# EAGLE board edcmain (EAGLE 9.6.2), part 1 of 2
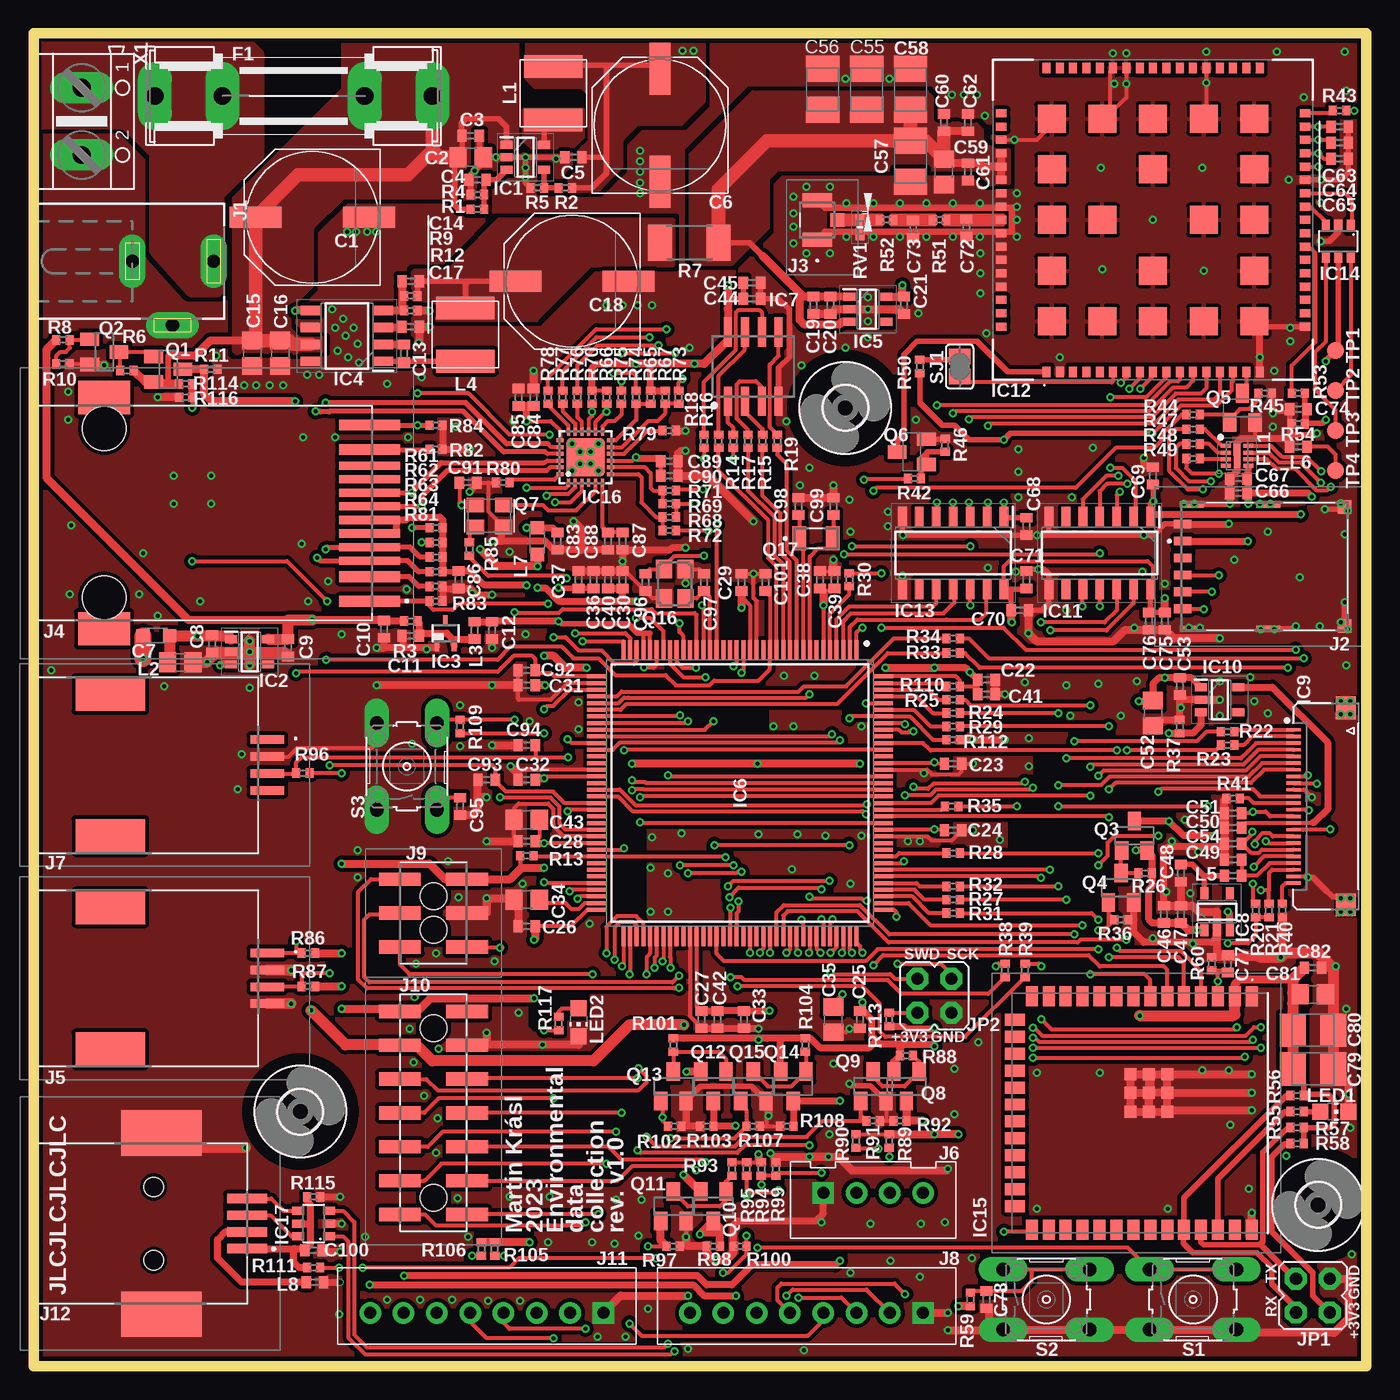
[diagram p7: board, top side]
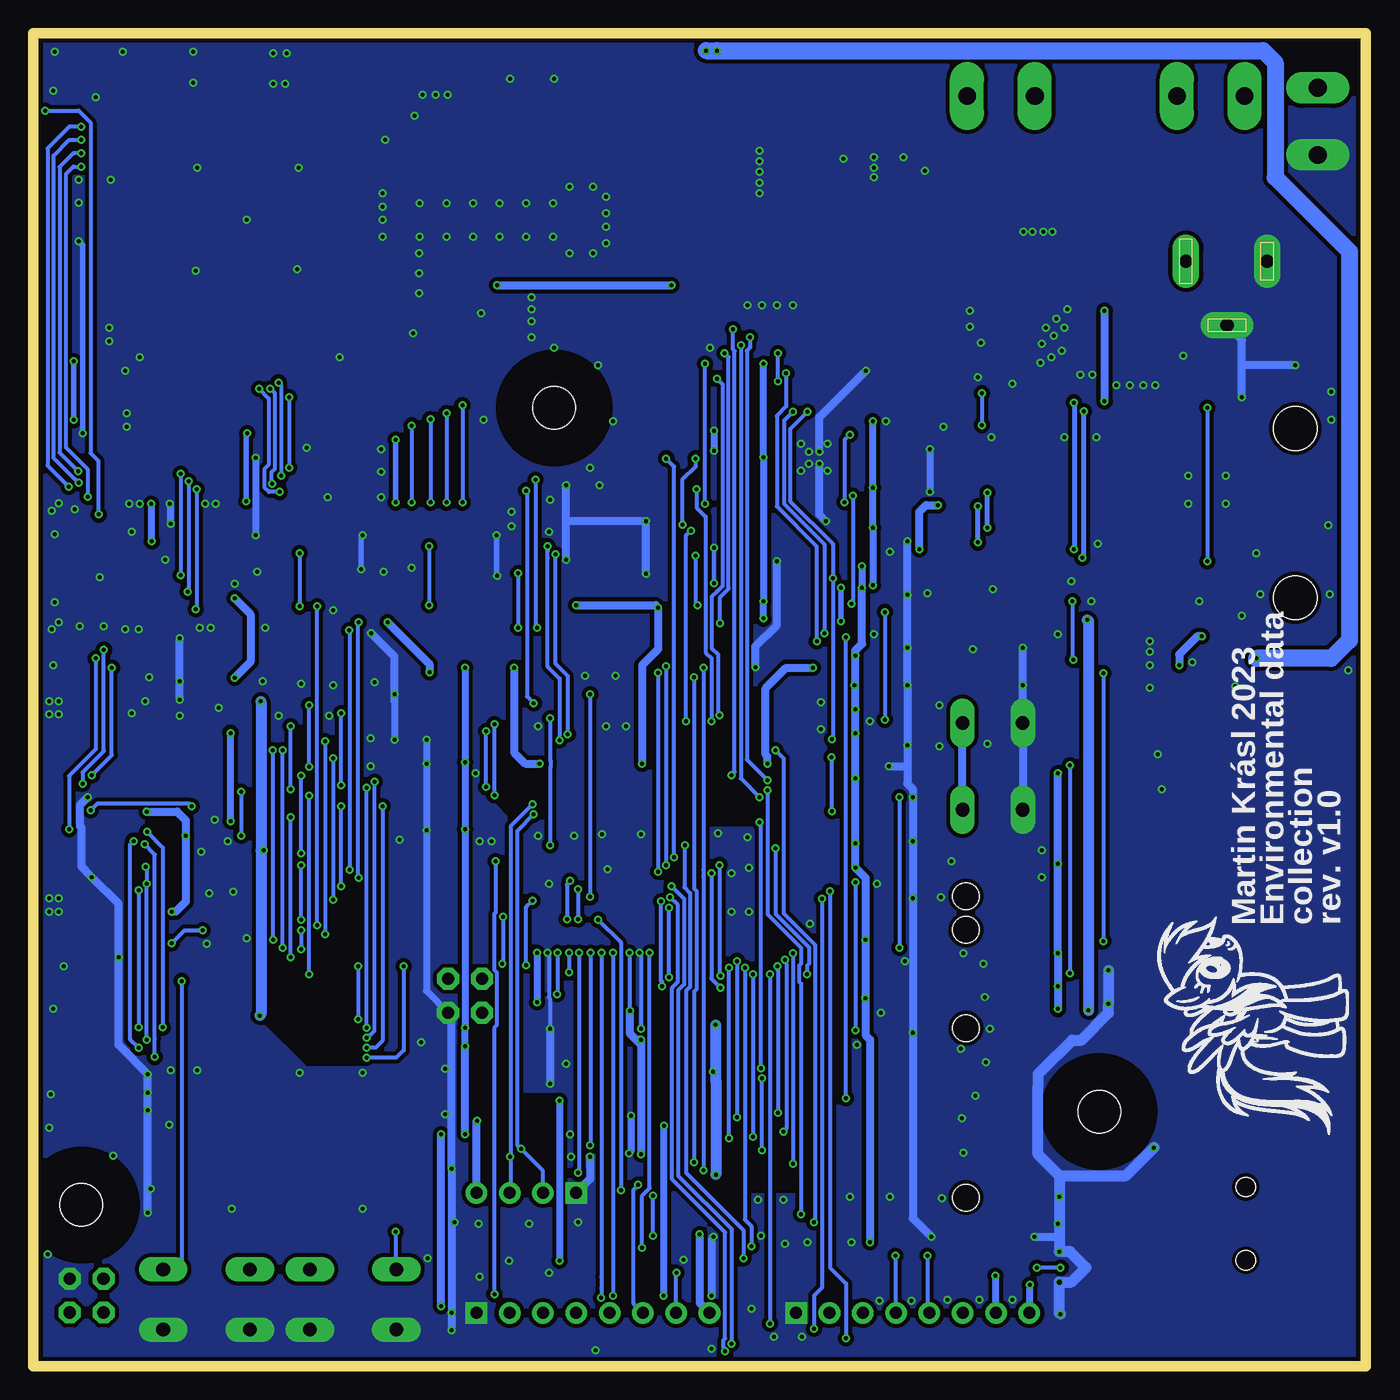
[diagram p8: board, bottom side, seen from below]

Size 100 x 100 mm. Coordinates in mm from the lower left corner, seen from the top.
Outline: 0,0 0,100 100,100 100,0 0,0
Copper layers (1*16): Top 0.035mm / dielectric 1.6mm / Bottom 0.035mm
Design rules "custom-jlcpcb": minimum track width 5mil, minimum drill 0.3mm, track to track 5mil, track to pad 5mil, pad to pad 5mil, via to via 5mil, smd to smd 0mil, copper to edge 0.2mm, drill to drill 6mil, minimum pad ring 10mil, minimum via ring 3mil, stop-mask expansion 4mil, vias tented up to drill 0.4mm, thermal gap 10mil
Net classes: 0 default: width 0.152 mm, clearance 0.152 mm; 1 usb: width 0.305 mm, clearance 0.203 mm; 2 ETH: width 0.305 mm, clearance 0.203 mm

## Footprints (pad centres in the part's own frame; a part is rotated, then mirrored left to right if it is on the bottom)
PANASONIC_G = smd 3.9 x 1.6: + 4.25,0; - -4.25,0
C0805 = smd 1.3 x 1.5: 1 -0.95,0; 2 0.95,0
C0402 = smd 0.7 x 0.9: 1 -0.65,0; 2 0.65,0
B/3528-21R = smd 1.95 x 2.5: + 1.525,0; - -1.525,0
SHK20L = drill 1.321 pad 2.54 long: 1A -10.414,0; 1B -5.334,0; 2A 10.414,0; 2B 5.334,0
SON50P160X210X65-9N = smd 0.75 x 0.3: 1 -0.85,0.75; 2 -0.85,0.25; 3 -0.85,-0.25; 4 -0.85,-0.75; 5 0.85,-0.75; 6 0.85,-0.25; 7 0.85,0.25; 8 0.85,0.75 | smd 0.5 x 1.8: 9 0,0
3,2 = hole 3.2: 0,0
SOT95P280X130-5N = smd 0.9 x 0.6: 1 -1.4,0.95; 2 -1.4,0; 3 -1.4,-0.95; 4 1.4,-0.95; 5 1.4,0.95
SC70-3 = smd 0.35 x 0.8: 1 -0.65,-0.95; 2 0.65,-0.95; 3 0,0.95
SOIC127P600X175-8N = smd 1.525 x 0.7: 1 -2.712,1.905; 2 -2.712,0.635; 3 -2.712,-0.635; 4 -2.712,-1.905; 5 2.712,-1.905; 6 2.712,-0.635; 7 2.712,0.635; 8 2.712,1.905
QFP50P2200X2200X160-144N = smd 1.475 x 0.3: 1 -10.738,8.75; 2 -10.738,8.25; 3 -10.738,7.75; 4 -10.738,7.25; 5 -10.738,6.75; 6 -10.738,6.25; 7 -10.738,5.75; 8 -10.738,5.25; 9 -10.738,4.75; 10 -10.738,4.25; 11 -10.738,3.75; 12 -10.738,3.25; 13 -10.738,2.75; 14 -10.738,2.25; 15 -10.738,1.75; 16 -10.738,1.25; 17 -10.738,0.75; 18 -10.738,0.25; 19 -10.738,-0.25; 20 -10.738,-0.75; 21 -10.738,-1.25; 22 -10.738,-1.75; 23 -10.738,-2.25; 24 -10.738,-2.75; 25 -10.738,-3.25; 26 -10.738,-3.75; 27 -10.738,-4.25; 28 -10.738,-4.75; 29 -10.738,-5.25; 30 -10.738,-5.75; 31 -10.738,-6.25; 32 -10.738,-6.75; 33 -10.738,-7.25; 34 -10.738,-7.75; 35 -10.738,-8.25; 36 -10.738,-8.75; 73 10.738,-8.75; 74 10.738,-8.25; 75 10.738,-7.75; 76 10.738,-7.25; 77 10.738,-6.75; 78 10.738,-6.25; 79 10.738,-5.75; 80 10.738,-5.25; 81 10.738,-4.75; 82 10.738,-4.25; 83 10.738,-3.75; 84 10.738,-3.25; 85 10.738,-2.75; 86 10.738,-2.25; 87 10.738,-1.75; 88 10.738,-1.25; 89 10.738,-0.75; 90 10.738,-0.25; 91 10.738,0.25; 92 10.738,0.75; 93 10.738,1.25; 94 10.738,1.75; 95 10.738,2.25; 96 10.738,2.75; 97 10.738,3.25; 98 10.738,3.75; 99 10.738,4.25; 100 10.738,4.75; 101 10.738,5.25; 102 10.738,5.75; 103 10.738,6.25; 104 10.738,6.75; 105 10.738,7.25; 106 10.738,7.75; 107 10.738,8.25; 108 10.738,8.75 | smd 0.3 x 1.475: 37 -8.75,-10.738; 38 -8.25,-10.738; 39 -7.75,-10.738; 40 -7.25,-10.738; 41 -6.75,-10.738; 42 -6.25,-10.738; 43 -5.75,-10.738; 44 -5.25,-10.738; 45 -4.75,-10.738; 46 -4.25,-10.738; 47 -3.75,-10.738; 48 -3.25,-10.738; 49 -2.75,-10.738; 50 -2.25,-10.738; 51 -1.75,-10.738; 52 -1.25,-10.738; 53 -0.75,-10.738; 54 -0.25,-10.738; 55 0.25,-10.738; 56 0.75,-10.738; 57 1.25,-10.738; 58 1.75,-10.738; 59 2.25,-10.738; 60 2.75,-10.738; 61 3.25,-10.738; 62 3.75,-10.738; 63 4.25,-10.738; 64 4.75,-10.738; 65 5.25,-10.738; 66 5.75,-10.738; 67 6.25,-10.738; 68 6.75,-10.738; 69 7.25,-10.738; 70 7.75,-10.738; 71 8.25,-10.738; 72 8.75,-10.738; 109 8.75,10.738; 110 8.25,10.738; 111 7.75,10.738; 112 7.25,10.738; 113 6.75,10.738; 114 6.25,10.738; 115 5.75,10.738; 116 5.25,10.738; 117 4.75,10.738; 118 4.25,10.738; 119 3.75,10.738; 120 3.25,10.738; 121 2.75,10.738; 122 2.25,10.738; 123 1.75,10.738; 124 1.25,10.738; 125 0.75,10.738; 126 0.25,10.738; 127 -0.25,10.738; 128 -0.75,10.738; 129 -1.25,10.738; 130 -1.75,10.738; 131 -2.25,10.738; 132 -2.75,10.738; 133 -3.25,10.738; 134 -3.75,10.738; 135 -4.25,10.738; 136 -4.75,10.738; 137 -5.25,10.738; 138 -5.75,10.738; 139 -6.25,10.738; 140 -6.75,10.738; 141 -7.25,10.738; 142 -7.75,10.738; 143 -8.25,10.738; 144 -8.75,10.738
SOP08 = smd 0.6 x 2.2: 1 -1.905,-2.6; 2 -0.635,-2.6; 3 0.635,-2.6; 4 1.905,-2.6; 5 1.905,2.6; 6 0.635,2.6; 7 -0.635,2.6; 8 -1.905,2.6
XF2M-2415-1A-SWAP = smd 0.25 x 1.1: 1 5.75,2.54; 2 5.25,2.54; 3 4.75,2.54; 4 4.25,2.54; 5 3.75,2.54; 6 3.25,2.54; 7 2.75,2.54; 8 2.25,2.54; 9 1.75,2.54; 10 1.25,2.54; 11 0.75,2.54; 12 0.25,2.54; 13 -0.25,2.54; 14 -0.75,2.54; 15 -1.25,2.54; 16 -1.75,2.54; 17 -2.25,2.54; 18 -2.75,2.54; 19 -3.25,2.54; 20 -3.75,2.54; 21 -4.25,2.54; 22 -4.75,2.54; 23 -5.25,2.54; 24 -5.75,2.54 | smd 1.7 x 1.5: 25 -7.4,-1.36; 26 7.4,-1.36
SOIC127P600X175-14N = smd 1.525 x 0.65: 1 -2.712,3.81; 2 -2.712,2.54; 3 -2.712,1.27; 4 -2.712,0; 5 -2.712,-1.27; 6 -2.712,-2.54; 7 -2.712,-3.81; 8 2.712,-3.81; 9 2.712,-2.54; 10 2.712,-1.27; 11 2.712,0; 12 2.712,1.27; 13 2.712,2.54; 14 2.712,3.81
A7670CLNSC = smd 0.8 x 0.6: 1 -11.4,8; 2 -11.4,7; 3 -11.4,6; 4 -11.4,5; 5 -11.4,4; 6 -11.4,3; 7 -11.4,2; 8 -11.4,1; 9 -11.4,0; 10 -11.4,-1; 11 -11.4,-2; 12 -11.4,-3; 13 -11.4,-4; 14 -11.4,-5; 15 -11.4,-6; 16 -11.4,-7; 17 -11.4,-8; 35 11.4,-8; 36 11.4,-7; 37 11.4,-6; 38 11.4,-5; 39 11.4,-4; 40 11.4,-3; 41 11.4,-2; 42 11.4,-1; 43 11.4,0; 44 11.4,1; 45 11.4,2; 46 11.4,3; 47 11.4,4; 48 11.4,5; 49 11.4,6; 50 11.4,7; 51 11.4,8 | smd 0.6 x 0.8: 18 -8,-11.4; 19 -7,-11.4; 20 -6,-11.4; 21 -5,-11.4; 22 -4,-11.4; 23 -3,-11.4; 24 -2,-11.4; 25 -1,-11.4; 26 0,-11.4; 27 1,-11.4; 28 2,-11.4; 29 3,-11.4; 30 4,-11.4; 31 5,-11.4; 32 6,-11.4; 33 7,-11.4; 34 8,-11.4; 52 8,11.4; 53 7,11.4; 54 6,11.4; 55 5,11.4; 56 4,11.4; 57 3,11.4; 58 2,11.4; 59 1,11.4; 60 0,11.4; 61 -1,11.4; 62 -2,11.4; 63 -3,11.4; 64 -4,11.4; 65 -5,11.4; 66 -6,11.4; 67 -7,11.4; 68 -8,11.4 | smd 2.1 x 2.1: 69 -7.6,7.6; 70 -7.6,3.8; 71 -7.6,0; 72 -7.6,-3.8; 73 -7.6,-7.6; 74 -3.8,-7.6; 75 0,-7.6; 76 3.8,-7.6; 77 7.6,-7.6; 78 7.6,-3.8; 79 7.6,0; 80 7.6,3.8; 81 7.6,7.6; 82 3.8,7.6; 83 0,7.6; 84 -3.8,7.6; 85 -3.8,0; 86 0,-3.8; 87 3.8,0; 88 0,3.8
SOT23-6 = smd 0.6 x 0.9: 1 -0.95,-1.15; 2 0,-1.15; 3 0.95,-1.15; 4 0.95,1.15; 5 0,1.15; 6 -0.95,1.15
ESP32S3WROOM1UN16R2 = smd 1.5 x 0.9: 1 -8.75,8.41; 2 -8.75,7.14; 3 -8.75,5.87; 4 -8.75,4.6; 5 -8.75,3.33; 6 -8.75,2.06; 7 -8.75,0.79; 8 -8.75,-0.48; 9 -8.75,-1.75; 10 -8.75,-3.02; 11 -8.75,-4.29; 12 -8.75,-5.56; 13 -8.75,-6.83; 14 -8.75,-8.1; 27 8.75,-8.1; 28 8.75,-6.83; 29 8.75,-5.56; 30 8.75,-4.29; 31 8.75,-3.02; 32 8.75,-1.75; 33 8.75,-0.48; 34 8.75,0.79; 35 8.75,2.06; 36 8.75,3.33; 37 8.75,4.6; 38 8.75,5.87; 39 8.75,7.14; 40 8.75,8.41 | smd 0.9 x 1.5: 15 -6.985,-9.35; 16 -5.715,-9.35; 17 -4.445,-9.35; 18 -3.175,-9.35; 19 -1.905,-9.35; 20 -0.635,-9.35; 21 0.635,-9.35; 22 1.905,-9.35; 23 3.175,-9.35; 24 4.445,-9.35; 25 5.715,-9.35; 26 6.985,-9.35 | smd 0.9 x 0.9: 41 -1.5,0.69; 42 -1.5,2.09; 43 -2.9,2.09; 44 -2.9,0.69; 45 -2.9,-0.71; 46 -1.5,-0.71; 47 -0.1,-0.71; 48 -0.1,0.69; 49 -0.1,2.09
QFN24 = smd 0.6 x 0.3: 1 -1.905,1.27; 2 -1.905,0.762; 3 -1.905,0.254; 4 -1.905,-0.254; 5 -1.905,-0.762; 6 -1.905,-1.27; 13 1.905,-1.27; 14 1.905,-0.762; 15 1.905,-0.254; 16 1.905,0.254; 17 1.905,0.762; 18 1.905,1.27 | smd 0.3 x 0.6: 7 -1.27,-1.905; 8 -0.762,-1.905; 9 -0.254,-1.905; 10 0.254,-1.905; 11 0.762,-1.905; 12 1.27,-1.905; 19 1.27,1.905; 20 0.762,1.905; 21 0.254,1.905; 22 -0.254,1.905; 23 -0.762,1.905; 24 -1.27,1.905 | smd 2.9 x 2.9: EXP 0,0
DCJ0202 = drill 1 pad 2 long: 1 0,3.1; 2 4.8,0; 3 0,-3
693043020611 = smd 0.65 x 1.3: C1 1.91,5.77; C2 -0.63,5.77; C3 -1.9,5.77; C5 3.18,5.77; C6 0.64,5.77; C7 -3.17,5.77 | smd 0.48 x 1.8: P1 -4.67,5.1; P2 -4.67,-0.65; P5 4.66,-0.65; P6 4.66,5.1 | smd 1.03 x 1: P3 -4.465,-6.37; P4 4.465,-6.37
UFLRSMT01 = smd 1.05 x 2.2: 1 -1.475,0; 2 1.475,0 | smd 1 x 1.05: 3 0,-1.525
J3011G21DNL = smd 0.81 x 4.6: 1 6.61,25.2; 2 4.77,25.2; 11 -4.77,25.2; 12 -6.61,25.2 | smd 0.61 x 4.6: 3 3.57,25.2; 4 2.55,25.2; 5 1.53,25.2; 6 0.51,25.2; 7 -0.51,25.2; 8 -1.53,25.2; 9 -2.55,25.2; 10 -3.57,25.2 | smd 2.5 x 3.9: MP1 8.67,5.28; MP2 -8.67,5.28 | hole 3.3: 6.35,5.28; -6.35,5.28
441440004 = smd 0.64 x 2.54: 1 -1.905,9.135; 2 -0.635,9.135; 3 0.635,9.135; 4 1.905,9.135 | smd 2.54 x 5.21: MP1 -5.33,-2.66; MP2 5.33,-2.66
B4B-XH-A = drill 0.9 square: 1 3.75,0 | drill 0.9: 2 1.25,0; 3 -1.25,0; 4 -3.75,0
B8B-XH-A = drill 0.9 square: 1 8.75,0 | drill 0.9: 2 6.25,0; 3 3.75,0; 4 1.25,0; 5 -1.25,0; 6 -3.75,0; 7 -6.25,0; 8 -8.75,0
M208750342 = smd 1 x 3.15: 1 -2.54,-2.525; 2 -2.54,2.525; 3 0,-2.525; 4 0,2.525; 5 2.54,-2.525; 6 2.54,2.525 | hole 2: -1.27,0; 1.27,0
M208750742 = smd 1 x 3.15: 1 -7.62,-2.525; 2 -7.62,2.525; 3 -5.08,-2.525; 4 -5.08,2.525; 5 -2.54,-2.525; 6 -2.54,2.525; 7 0,-2.525; 8 0,2.525; 9 2.54,-2.525; 10 2.54,2.525; 11 5.08,-2.525; 12 5.08,2.525; 13 7.62,-2.525; 14 7.62,2.525 | hole 2: -6.35,0; 6.35,0
62910416121 = smd 0.7 x 3: 1 1.875,16; 2 -0.625,16; 3 -1.875,16; 4 0.625,16 | smd 3.4 x 6.04: MP1 6.8,9.6; MP2 -6.8,9.6 | hole 1.45: 2.75,9; -2.75,9
JP2Q = drill 0.914 octagon: 1 -1.27,-1.27; 2 -1.27,1.27; 3 1.27,-1.27; 4 1.27,1.27
L6 = smd 1.7 x 4.4: P$1 -2,0; P$2 2,0
L2012C = smd 1 x 1: 1 -1,0; 2 1,0
0402 = smd 0.7 x 0.9: 1 -0.65,0; 2 0.65,0
CHIP-LED0805 = smd 1.2 x 1.2: A 0,-1.05; C 0,1.05
SOT23 = smd 1 x 1.4: 1 -0.95,-1.1; 2 0.95,-1.1; 3 0,1.1
SOT23-BEC = smd 1 x 1.4: B -0.95,-1.1; C 0,1.1; E 0.95,-1.1
CRYSTAL3.2X2.5 = smd 1.295 x 1.092: 1 -1.054,-0.826; 2 1.054,-0.826; 3 1.054,0.826; 4 -1.054,0.826
CRYSTAL3.2X2.5' = smd 1.4 x 1.2: 1 -1.1,-0.8; 2 1.1,-0.8; 3 1.1,0.8; 4 -1.1,0.8
NX3215SA32768KEXS00AMU00003 = smd 1 x 1.8: 1 -1.25,0; 2 1.25,0
R0402 = smd 0.6 x 0.7: 1 -0.5,0; 2 0.5,0
R2010 = smd 1.8 x 2.7: 1 -2.2,0; 2 2.2,0
VARC1005X41N = smd 0.85 x 0.65: 1 -0.55,0; 2 0.55,0
B3F-10XX = drill 1.016 long: 1 -3.251,2.261; 2 3.251,2.261; 3 -3.251,-2.261; 4 3.251,-2.261
SJ = smd 1.168 x 1.6: 1 -0.762,0; 2 0.762,0
B1,27 = smd 1.27 x 1.27: TP 0,0
AK500/2 = drill 1.321 long: 1 -2.515,0; 2 2.515,0

## Placement (x,y rotation side)
C1  330uF  [PANASONIC_G]  20.9,86.2 180 top
C2  1uF  [C0805]  32.8,90.7 0 top
C3  100nF  [C0402]  32.8,92.3 0 top
C4  100nF  [C0402]  33.3,89 180 top
C5  100nF  [C0402]  40.5,90.7 180 top
C6  330uF  [PANASONIC_G]  47,93.1 90 top
C7  2.2uF  [C0805]  11,52.8 0 top
C8  100nF  [C0402]  13.4,54.2 270 top
C9  100nF  [C0402]  19.1,53.9 270 top
C10  100nF  [C0402]  26.3,55.3 270 top
C11  100nF  [C0402]  28.3,54.8 180 top
C12  100nF  [C0402]  34.4,55.2 270 top
C13  100nF  [C0402]  27.8,76 270 top
C14  15pF  [C0402]  28.3,81.4 180 top
C15  1uF  [C0805]  16.4,76 270 top
C16  1uF  [C0805]  18.5,76 270 top
C17  1uF  [C0402]  28.3,78 0 top
C18  33uF  [PANASONIC_G]  40.4,81.4 180 top
C19  2.2uF  [C0402]  58.5,79.6 270 top
C20  100nF  [C0402]  59.8,79.6 270 top
C21  100nF  [C0402]  65.3,79.6 270 top
C22  100nF  [C0402]  71.5,51.5 0 top
C23  100nF  [C0402]  69,45.2 0 top
C24  100nF  [C0402]  69,40.2 0 top
C25  100nF  [C0402]  62,26 270 top
C26  100nF  [C0402]  37,33 180 top
C27  100nF  [C0402]  50.1,26 270 top
C28  100nF  [C0402]  37,39.4 180 top
C29  100nF  [C0402]  53.1,58.8 90 top
C30  100nF  [C0402]  44.2,59 90 top
C31  100nF  [C0402]  37,51.1 180 top
C32  100nF  [C0402]  37,44 180 top
C33  4.7uF  [C0402]  53.3,26 270 top
C34  2.2uF  [C0805]  37,35 180 top
C35  2.2uF  [C0805]  60,26 270 top
C36  100nF  [C0402]  42,59 90 top
C37  1.0uF  [C0402]  40.9,59 90 top
C38  100nF  [C0402]  59,59 90 top
C39  1uF  [C0402]  60.1,59 90 top
C40  2.2uF  [C0402]  43.1,59 90 top
C41  2.2uF  [C0402]  71.5,50.4 0 top
C42  2.2uF  [C0402]  51.3,26 270 top
C43  2.2uF  [C0805]  37,41 180 top
C44  100nF  [C0402]  53.9,80.1 0 top
C45  2.2uF  [C0402]  53.9,81.3 0 top
C46  2.2uF  [C0402]  84.8,33.9 90 top
C47  100nF  [C0402]  86.1,33.9 90 top
C48  100nF  [C0402]  86.1,37 270 top
C49  100nF  [C0402]  90,38 180 top
C50  100nF  [C0402]  90,40.4 180 top
C51  100nF  [C0402]  90,41.5 180 top
C52  2.2uF  [C0805]  84,49 270 top
C53  100nF  [C0402]  86,51 270 top
C54  100nF  [C0402]  90,39.2 180 top
C55  100uF  [B/3528-21R]  62.5,95.8 270 top
C56  100uF  [B/3528-21R]  59.2,95.8 270 top
C57  100uF  [B/3528-21R]  65.8,90.4 90 top
C58  100uF  [B/3528-21R]  65.8,95.8 270 top
C59  1uF  [C0805]  68.3,89.6 270 top
C60  100nF  [C0402]  68.3,93.3 90 top
C61  33pF  [C0402]  70.1,89.6 270 top
C62  10pF  [C0402]  70.1,93.3 90 top
C63  22pF  [C0402]  98,93 0 top
C64  22pF  [C0402]  98,91.8 0 top
C65  22pF  [C0402]  98,90.6 0 top
C66  33pF  [C0402]  90.4,65.5 180 top
C67  100nF  [C0402]  90.4,66.6 180 top
C68  100nF  [C0402]  74.5,63 270 top
C69  100nF  [C0402]  84,66.8 90 top
C70  2.2uF  [C0402]  74,56.7 0 top
C71  100nF  [C0402]  74.5,59 90 top
C72  DNF  [C0402]  70,85.4 270 top
C73  DNF  [C0402]  66,85.3 270 top
C74  4.7uF  [C0402]  94.9,71.8 180 top
C75  2.2uF  [C0402]  84.9,55.9 270 top
C76  100nF  [C0402]  83.7,55.9 270 top
C77  100nF  [C0402]  89.6,30.2 90 top
C78  100nF  [C0402]  71.5,5 270 top
C79  100uF  [B/3528-21R]  96,22.3 180 top
C80  100uF  [B/3528-21R]  96,25.2 180 top
C81  1uF  [C0805]  96,27.9 0 top
C82  100nF  [C0402]  96,29.9 0 top
C83  1uF  [C0402]  39.3,61.9 270 top
C84  100nF  [C0402]  37.5,72.7 90 top
C85  100nF  [C0402]  36.4,72.7 90 top
C86  22nF  [C0402]  31.9,59 270 top
C87  470pF  [C0402]  44.2,61.9 270 top
C88  1uF  [C0402]  43.1,61.9 90 top
C89  1uF  [C0402]  47.7,67.9 0 top
C90  100nF  [C0402]  47.7,66.8 0 top
C91  100nF  [C0402]  32.6,66.3 0 top
C92  100pF  [C0402]  37,52.2 180 top
C93  100pF  [C0402]  34,44 180 top
C94  100pF  [C0402]  37,46.6 180 top
C95  100nF  [C0402]  32,42 270 top
C96  20pF  [C0402]  45.9,58.8 270 top
C97  20pF  [C0402]  50.3,58.8 90 top
C98  4p7  [C0402]  57.4,64.5 90 top
C99  4p7  [C0402]  60,64.5 90 top
C100  4.7uF  [C0402]  21,8.7 0 top
C101  10nF  [C0402]  54.9,58.8 90 top
F1  [SHK20L]  19.5,95.3 0 top
FL1  TPD3F303DPVR  [SON50P160X210X65-9N]  90.3,68.3 0 top
H1  MOUNT-HOLE3.2  [3,2]  20,19.1 0 top
H2  MOUNT-HOLE3.2  [3,2]  96.4,12.1 0 top
H3  MOUNT-HOLE3.2  [3,2]  60.9,71.9 0 top
IC1  XC9263B75CMR-G  [SOT95P280X130-5N]  36.9,90.7 0 top
IC2  XC6227C501MR-G  [SOT95P280X130-5N]  16.2,53.6 0 top
IC3  LM4050CEX3-3  [SC70-3]  30.9,55 0 top
IC4  L6981NDR  [SOIC127P600X175-8N]  23.5,77.3 180 top
IC5  XC6210B332MR-G  [SOT95P280X130-5N]  62.6,79.3 0 top
IC6  STM32H723ZGT6  [QFP50P2200X2200X160-144N]  53,43 270 top
IC7  APS6404L-3SQR-SN  [SOP08]  54,75 0 top
IC8  XC6504A281MR-G  [SOT95P280X130-5N]  88.8,34.1 90 top
IC9  OV2640  [XF2M-2415-1A-SWAP]  97.1,42 90 top
IC10  XC6224A121MR-G  [SOT95P280X130-5N]  89,50 0 top
IC11  TXB0104DR  [SOIC127P600X175-14N]  80,61 270 top
IC12  A7670E  [A7670CLNSC]  84,86 90 top
IC13  TXB0104DR  [SOIC127P600X175-14N]  69,61 270 top
IC14  USBLC6-2  [SOT23-6]  97.9,84.4 180 top
IC15  ESP32-S3-WROOM-1U-N16R2  [ESP32S3WROOM1UN16R2]  83,19 270 top
IC16  LAN8720  [QFN24]  41.4,68.2 90 top
IC17  USBLC6-2  [SOT23-6]  21,10.7 90 top
IMG1  IMAGEPRINT  [RD_14_24_PRINT]  8.2,26.6 90 bottom
J1  DCJ0202  [DCJ0202]  10.4,82.9 270 top
J2  693043020611  [693043020611]  92,60 90 top
J3  U.FL-R-SMT_01_  [UFLRSMT01]  58.8,86 90 top
J4  J3011G21DNL  [J3011G21DNL]  0,64 270 top
J5  44144-0004  [441440004]  8.4,29.1 270 top
J6  JST-XH-4  [B4B-XH-A]  63,13 180 top
J7  44144-0004  [441440004]  8.4,45.1 270 top
J8  JST-XH-8  [B8B-XH-A]  58,4 0 top
J9  M20-8750342  [M208750342]  30,34 90 top
J10  M20-8750742  [M208750742]  30,19 90 top
J11  JST-XH-8  [B8B-XH-A]  34,4 0 top
J12  62910416121  [62910416121]  0,10.7 270 top
JP1  [JP2Q]  96,5.3 90 top
JP2  [JP2Q]  67.6,27.8 0 top
L1  10uH  [L6]  39,95.5 90 top
L2  LCBB-601  [L2012C]  9.2,54.8 180 top
L3  ferit  [0402]  33.1,55.2 90 top
L4  27uH  [L6]  32.4,77.4 90 top
L5  ferit  [0402]  90,36.8 0 top
L6  ferit  [0402]  94.9,69 0 top
L7  fcm1608-0603  [L2012C]  37.8,61.9 90 top
L8  ferit  [0402]  21.1,6.3 180 top
LED1  [CHIP-LED0805]  97.6,19.1 270 top
LED2  [CHIP-LED0805]  40.9,25.8 180 top
Q1  BSS84  [SOT23]  10.1,74.8 270 top
Q2  BSS123  [SOT23]  5.3,76.1 270 top
Q3  NTR0202PLT1G  [SOT23]  82.6,39.8 0 top
Q4  BSS123  [SOT23]  81.6,35.9 0 top
Q5  BC817-40  [SOT23-BEC]  90.7,71.9 0 top
Q6  BC817-40  [SOT23-BEC]  65.9,68.6 90 top
Q7  ASE-25.000MHZ-LR-T  [CRYSTAL3.2X2.5]  34.2,63.8 0 top
Q8  NTR0202PLT1G  [SOT23]  65.5,21 180 top
Q9  BSS123  [SOT23]  63,21 0 top
Q10  NTR0202PLT1G  [SOT23]  51,12 180 top
Q11  BSS123  [SOT23]  48,12 0 top
Q12  NTR0202PLT1G  [SOT23]  51,21 180 top
Q13  BSS123  [SOT23]  48,21 0 top
Q14  NTR0202PLT1G  [SOT23]  57,21 180 top
Q15  BSS123  [SOT23]  54,21 0 top
Q16  8MHz  [CRYSTAL3.2X2.5']  48.1,58.7 90 top
Q17  32.768kHz  [NX3215SA32768KEXS00AMU00003]  58.7,62.1 0 top
R1  22k  [R0402]  33.3,86.8 0 top
R2  680k  [R0402]  39.9,88.4 0 top
R3  200R  [R0402]  28.3,55.9 180 top
R4  16k  [R0402]  33.3,87.9 0 top
R5  110k  [R0402]  37.8,88.4 0 top
R6  100k  [R0402]  7,74.7 180 top
R7  FERIT?  [R2010]  49.2,84.3 0 top
R8  1k  [R0402]  2.2,77 180 top
R9  300k  [R0402]  28.3,80.3 0 top
R10  100k  [R0402]  2.2,75.2 180 top
R11  1k  [R0402]  13.3,74.8 180 top
R12  80k6  [R0402]  28.3,79.2 180 top
R13  10k  [R0402]  37,38.3 180 top
R14  33R  [R0402]  52.5,69.4 90 top
R15  33R  [R0402]  54.7,69.4 90 top
R16  33R  [R0402]  51.4,69.4 270 top
R17  33R  [R0402]  53.6,69.4 90 top
R18  33R  [R0402]  50.3,69.4 270 top
R19  33R  [R0402]  55.8,69.4 270 top
R20  4k7  [R0402]  91.7,34.2 270 top
R21  4k7  [R0402]  92.7,34.2 270 top
R22  33R  [R0402]  89.6,47.6 180 top
R23  33R  [R0402]  89.6,46.6 180 top
R24  33R  [R0402]  69,49 180 top
R25  33R  [R0402]  69,50 180 top
R26  100k  [R0402]  83.4,37 0 top
R27  33R  [R0402]  69,35 180 top
R28  33R  [R0402]  69,38.5 180 top
R29  33R  [R0402]  69,48 180 top
R30  33R  [R0402]  61.2,59 270 top
R31  33R  [R0402]  69,34 180 top
R32  33R  [R0402]  69,36 180 top
R33  33R  [R0402]  69,53.5 180 top
R34  33R  [R0402]  69,54.6 180 top
R35  33R  [R0402]  68.9,42 180 top
R36  100k  [R0402]  81.6,33.5 180 top
R37  1k  [R0402]  86,48 270 top
R38  33R  [R0402]  72.9,29.7 270 top
R39  33R  [R0402]  74.4,29.7 270 top
R40  10k  [R0402]  93.7,34.2 90 top
R41  10k  [R0402]  90,42.6 0 top
R42  4k7  [R0402]  66.1,66.6 0 top
R43  10k  [R0402]  98,94.2 0 top
R44  4k7  [R0402]  87,71.4 0 top
R45  47k  [R0402]  92.4,73 180 top
R46  47k  [R0402]  68.4,69.1 270 top
R47  22R  [R0402]  87,70.3 180 top
R48  22R  [R0402]  87,69.2 180 top
R49  22R  [R0402]  87,68.1 180 top
R50  10k  [R0402]  66.5,75 270 top
R51  0R  [R0402]  68,86 180 top
R52  0R  [R0402]  64,86 180 top
R53  4k7  [R0402]  94.9,73 180 top
R54  10k  [R0402]  94.9,70.7 0 top
R55  1k  [R0402]  94.8,19.1 0 top
R56  100k  [R0402]  94.8,20.3 0 top
R57  100k  [R0402]  94.8,17.9 0 top
R58  0R  [R0402]  94.8,16.7 0 top
R59  100k  [R0402]  70.3,5 270 top
R60  100k  [R0402]  88.4,30.2 270 top
R61  49R9  [R0402]  30.2,62.9 0 top
R62  49R9  [R0402]  30.2,61.8 0 top
R63  49R9  [R0402]  30.2,60.7 0 top
R64  49R9  [R0402]  30.2,59.6 0 top
R65  1k5  [R0402]  46.3,72.7 90 top
R66  4k7  [R0402]  43,72.7 90 top
R67  4k7  [R0402]  47.4,72.7 90 top
R68  4k7  [R0402]  47.7,63.7 0 top
R69  4k7  [R0402]  47.7,64.7 0 top
R70  4k7  [R0402]  41.9,72.7 90 top
R71  22R  [R0402]  47.7,65.7 180 top
R72  22R  [R0402]  47.7,62.7 180 top
R73  22R  [R0402]  48.4,72.7 270 top
R74  22R  [R0402]  45.2,72.7 270 top
R75  22R  [R0402]  44.1,72.7 270 top
R76  22R  [R0402]  40.8,72.7 270 top
R77  22R  [R0402]  39.7,72.7 270 top
R78  22R  [R0402]  38.6,72.7 270 top
R79  4k7  [R0402]  47.7,70.2 180 top
R80  12k1  [R0402]  35.2,66.3 180 top
R81  270R  [R0402]  30.2,58.5 0 top
R82  270R  [R0402]  30.2,68.8 0 top
R83  10k  [R0402]  30.2,57.4 180 top
R84  10k  [R0402]  30.2,70.6 180 top
R85  0R  [R0402]  32.7,61.3 270 top
R86  33k  [R0402]  20.6,31 0 top
R87  100k  [R0402]  20.6,28.5 0 top
R88  10k  [R0402]  65.5,23.3 0 top
R89  4k7  [R0402]  64.2,16.9 90 top
R90  4k7  [R0402]  61.7,16.9 90 top
R91  100k  [R0402]  63,18.4 180 top
R92  1k  [R0402]  65,18.4 0 top
R93  10k  [R0402]  52.4,14.8 270 top
R94  1k  [R0402]  54.6,14.8 90 top
R95  1k  [R0402]  53.5,14.8 90 top
R96  100k  [R0402]  20.2,44.5 0 top
R97  100k  [R0402]  48,9 180 top
R98  1k  [R0402]  51,9 0 top
R99  1k  [R0402]  55.7,14.8 270 top
R100  1k  [R0402]  53,9 0 top
R101  10k  [R0402]  48,24.1 270 top
R102  100k  [R0402]  48.1,18 180 top
R103  1k  [R0402]  50.5,18 0 top
R104  10k  [R0402]  57.9,24.1 270 top
R105  4k7  [R0402]  34.6,8.8 90 top
R106  4k7  [R0402]  33.6,8.8 90 top
R107  100k  [R0402]  54,18 180 top
R108  1k  [R0402]  56.5,18 0 top
R109  100k  [R0402]  32,48 270 top
R110  10k  [R0402]  69,51 0 top
R111  4k7  [R0402]  21,7.4 180 top
R112  10k  [R0402]  69,47 180 top
R113  0R  [R0402]  64.2,26 270 top
R114  100k  [R0402]  11.4,73.7 180 top
R115  10k  [R0402]  21,12.7 180 top
R116  47k  [R0402]  11.4,72.7 0 top
R117  1k  [R0402]  39.4,25.7 90 top
RV1  CG0402MLU-3.3G  [VARC1005X41N]  62,85.45 270 top
S1  [B3F-10XX]  87,5 0 top
S2  [B3F-10XX]  76,5 0 top
S3  [B3F-10XX]  28,45 90 top
SJ1  [SJ]  69.5,75 90 top
TP1  TPB1,27  [B1,27]  97.7,76.2 0 top
TP2  TPB1,27  [B1,27]  97.7,73.2 0 top
TP3  TPB1,27  [B1,27]  97.7,70.2 0 top
TP4  TPB1,27  [B1,27]  97.7,67.2 0 top
X1  [AK500/2]  3.6,93.4 270 top

## Tracks (layer width: path | path; a pad name or v marks a point on that pad's centre or on a via)
50OHM_1
  Top 0.406: 70.3,86.1 C72.1
  Top 0.5: R51.1 68.5,86.25 69,86.25 | 71,85.75 72.75,85.75 72.75,86.25 71,86.25 | 71,85.75 68.5,85.75 | 68.5,85.75 R51.1 | 69,86.25 71,86.25 | 69,86.25 68.4,86.25 68.4,85.75 68.5,85.75 | C72.1 70,86.1 70.3,86.1 | 71,85.75 71,86.25 | IC12.60 70,86 C72.1 | C72.1 68.5,86.05 R51.1
50OHM_2
  Top 0.5: 67.5,86.25 67.5,85.75 | 67.5,85.75 65,85.75 | 65,85.75 64.5,85.75 R52.1 64.5,86.25 65,86.25 | 65,86.25 67.5,86.25 | 65,86.25 64.4,86.25 64.4,85.75 65,85.75 | 67.5,86.25 R51.2 66,86 C73.1 | 67.5,86.25 67.6,86.25 67.6,85.75 67.5,85.75
50OHM_3
  Top 0.152: J3.3 RV1.1
  Top 0.5: 60.33,86.25 J3.3 | J3.3 60.33,86.25 | 63.5,86.25 63.5,85.75 62.6,85.75 | 62.6,85.75 60.33,85.75 J3.3 | 60.33,86.25 63.5,86.25 | 63.5,86.25 R52.2 RV1.1 | 63.5,86.25 63.6,86.25 63.6,85.75 62.6,85.75
+3V3  (via drill 0.3 pad 0.6)
  Top 0.305: IC6.17 53.75,57.1 53.1,57.75 C29.1 | C38.1 59.17,58.17 | 59.17,58.17 59.25,58.1 | v59.25,57.1 IC6.6 | C39.1 59.92,58.17 59.17,58.17 | C22.1 C41.1 70.85,51 R110.2 69.5,51.45 69.2,51.75 IC6.144 | C24.1 68.3,40.25 67.6,40.25 | 67.6,40.25 IC6.121 | IC6.131 67.6,45.25 67.65,45.2 C23.1 67.7,45.2 v67.6,45.3 | R21.2 R20.2 91.7,32.3 91.13,31.73 v89.62,31.73 | R94.2 R95.2 R93.1 | IC13.14 72.81,60.01 73.2,60.4 83.6,60.4 84,60 84,58.48 IC11.14 | R90.2 R89.2 | IC6.84 49.75,27 C27.1 | IC6.72 41.55,34.25 40.3,33 C26.1 | IC6.62 v38.3,39.25 | C43.1 37.95,39.7 C28.1 | 62.2,26.85 C25.1 | IC6.108 61.75,31.8 62.02,31.52 62.02,31.18 v62.2,31 | IC6.95 v55.25,31.01 v55.26,31 | C32.1 37.9,44.25 IC6.52 | C89.1 C90.1 | C91.1 31.95,64.75 v32.1,64.6 | R66.2 R70.2 | IC16.9 44.95,67.95 v45.2,68.2 | v49.61,64.7 R69.2 R68.2 | v38.3,49.29 38.55,49.54 38.99,49.54 40.2,50.75 IC6.39 | IC6.30 47.25,55.15 46.3,56.1 v45.2,56.1 | R13.2 36.5,37.6 36.7,37.4 v38.3,37.4 | R96.2 21.94,44.5 21.95,44.49 v23.1,44.49 | R109.2 v38.3,47.5 | C79.+ 94.47,21.93 94.9,21.5 | v67.6,40.3 67.6,40.25
  Top 0.406: 94.9,21.5 95.3,21.1 R56.2 95.4,20.4 97.1,20.4 97.6,19.9 97.6,18.2 97.3,17.9 R57.2 R58.2 | C71.1 74.44,58.29 IC13.14 72.84,58.26 73.35,58.26 C70.1 | IC11.14 83.81,56.66 C76.1 C75.1 | C45.1 C44.1 52.4,80.1 52.09,79.8 IC7.8
  Top 0.508: C46.1 83.95,33.25 83.7,33.5 83.7,35.8 83.9,36 R26.2 83.9,38.35 Q3.2 v82.7,38.7 | Q14.2 56.05,24.6 | 56.05,24.6 R104.1 58.3,24.6 59,23.9 62.7,23.9 63.25,24.45 | v55.2,26.65 C33.1 C42.1 C27.1 | IC10.1 86.9,51.65 C53.1 v84.9,51.65 84.45,51.65 84,51.2 C52.1 83.92,49.87 v82.92,49.87 | v62.2,27.3 62.2,26.85 | R70.2 41.9,74.9 42.21,75.21 v45.2,75.21 46.4,75.21 | R67.2 R65.2 46.3,75.11 46.4,75.21 | 46.4,75.21 v49.6,75.21 50.31,75.21 52.09,77 IC7.8 | L7.1 v37.8,60 | v37.8,58.4 38.4,58.4 39.4,57.4 v45.2,57.4 44.2,57.4 C30.1 C40.1 | C89.1 47.05,68.1 45.3,68.1 v45.2,68.2 | C22.1 v70.28,52.08 69.95,52.4 v67.6,52.4 | R113.2 65.3,25.5 65.5,25.3 67.5,25.3 v67.6,25.41 | Q8.2 64.55,22.85 R88.1 65,23.84 65.3,24.14 | 65.3,24.14 67.46,24.14 v67.6,24 | 63.25,24.45 63.56,24.14 65.3,24.14 | 63.25,24.45 62.9,24.8 62.9,26 62.25,26.65 C25.1 | 56.05,24.6 55.1,24.6 55.09,24.59 54.4,24.59 | R101.1 48.77,24.6 48.78,24.59 54.4,24.59 | C28.1 37.8,39.25 v38.3,39.25 | v54.4,24.5 54.4,24.59
  Top 0.61: IC8.1 v87.3,32.7 86.65,32.7 C47.1 C46.1 | IC5.5 C21.1 65.2,80.35 v65.2,81.1 | R89.2 v67.6,17.4 v69.4,17.4 | R59.2 v69.4,4.5 | C75.1 v84.9,57.6 | C70.1 73.35,55.85 v73.4,55.8 | C29.1 v53.1,56.9 | v44.9,45.2 v54.3,45.2 v62,45.2 | v41.5,52.4 39.9,52.4 39,53.3 v38.3,53.3 | C38.1 59.25,58.1 v59.25,57.1 | v63.9,52.4 v67.6,52.4 | C32.1 37.75,44.1 v38.3,44.1 | v38.3,37.4 36.6,37.4 35.74,36.54 J9.5 30.86,36.54 29.7,37.7 v23.1,37.7 | v37.54,31.99 37.65,32.1 C26.1 | R106.2 R105.2 v37.2,9.3 | v37.54,27.6 29.8,27.6 28.82,26.62 J10.14 27.3,26.8 v23.1,26.8 | R86.2 v23.1,31 | R87.2 v23.1,28.5 | v37.8,60 34.8,60 v33.5,61.3 | Q7.4 32.13,64.63 v32.1,64.6 | v52.1,81.1 52.1,79.31 52.09,79.3 52.09,76.99 50.31,75.21 v45.2,75.21 | v54.4,15.89 54.4,15.5 R94.2 | v38.39,51.1 C31.1 | IC15.2 90.14,28.68 90.2,28.74 90.24,28.74 90.52,29.02 94.47,29.02
  Top 0.813: C82.1 94.97,29.52 94.47,29.02 94.47,28 | 94.47,28 94.47,27.2 C80.+ C79.+ | IC15.2 90.14,26.4 90.04,26.3 v83,26.3 | C81.1 94.95,28 94.47,28
  Bottom 0.305: v55.26,31 55.26,26.65 v55.2,26.65 | v49.61,64.7 v49.61,75.2 v49.6,75.21 | v38.39,51.1 38.3,51.01 v38.3,49.29 | v89.62,31.73 88.65,32.7 v87.3,32.7
  Bottom 0.508: v62.2,31 v62.2,27.3 | v37.8,60 v37.8,58.4 | v45.2,75.21 v45.2,68.2 v45.2,57.4 v45.2,56.1 | v67.6,52.4 v67.6,45.3 v67.6,40.3 v67.6,25.41 v67.6,24
  Bottom 0.61: v38.3,49.29 v38.3,47.5 v38.3,44.1 v38.3,39.25 v38.3,37.4 37.54,36.64 v37.54,31.99 | v38.3,49.29 38.3,51.01 v38.3,53.3 38.3,53.7 37.8,54.2 v37.8,58.4 | v38.3,49.29 | 54.4,24.13 v54.4,24.5 54.77,24.5 | 54.4,24.13 v54.4,15.89 | v67.6,17.4 v67.6,24 | v69.4,4.5 v69.4,17.4 | v82.7,38.7 82.91,38.7 | v84.9,51.65 83.7,52.85 83.7,56.4 v84.9,57.6 | v73.4,55.8 70.28,52.67 v70.28,52.08 | v54.3,45.2 54.3,52.6 53.1,53.8 v53.1,56.9 53.3,57.1 v59.25,57.1 | v44.9,45.2 44.9,45.74 45.05,45.89 45.05,50.85 43.5,52.4 v41.5,52.4 | v63.9,52.4 v63.91,52.4 63.91,46.03 63.08,45.2 v62,45.2 | v37.54,31.99 | v55.2,26.65 55.2,24.93 54.77,24.5 | 54.4,24.13 54.77,24.5 | v37.54,31.99 v37.54,27.6 37.54,24.84 37.2,24.5 v37.2,9.3 | v23.1,26.8 v23.1,28.5 v23.1,31 v23.1,37.7 v23.1,44.49 | v33.5,61.3 33.5,64.1 33,64.6 v32.1,64.6 | v65.2,81.1 v52.1,81.1
  Bottom 0.813: v83,26.3 82.91,26.39 82.91,38.7 v82.91,49.87 v82.92,49.87
+4V
  Top 0.406: 54.7,83.3 53.7,84.3 R7.2
  Top 0.61: IC5.1 C20.1 C19.1 57.75,80.25 57.5,80.5 | 57.5,80.5 54.7,83.3 | IC5.3 60.65,78.35 60.44,78.14 57.86,78.14 57.5,78.5 57.5,80.5 | IC12.56 71.2,90 70.9,90.3 70.15,90.3 C61.1 68.6,90.25 C59.1 | C62.1 C60.1 | IC12.55 IC12.56 | IC12.56 IC12.57
  Top 1.016: C58.+ C57.+ | C57.+ 55.02,91.92 51.4,88.3 R7.2 | C57.+ 66.92,91.92 C59.1 C60.1
  pour Top (isolate 0.305, no thermals): 49.8,82.7 52.4,82.7 55.1,85.4 55.1,89.1 55.8,89.8 70.7,89.8 71.8,88.7 73.1,88.7 73.2,88.8 73.2,91.2 73,91.4 71.7,91.4 71.2,91.9 71.2,92.7 70.7,93.2 67.8,93.2 67.4,93.6 67.4,95.2 67.05,95.55 53.95,95.55 49.3,90.9 49.3,83.2
+5V  (via drill 0.3 pad 0.6)
  Top 0.508: R3.2 26.35,55.9 C10.1
  Top 0.61: v48.77,14.38 Q10.2 | Q12.2 v49,22.1 | v20.9,56 26.25,56 26.35,55.9 | 19.1,56 11.6,56 0.94,66.66 0.94,76.24 R8.2
  Top 0.813: IC2.5 C9.1 19.1,56 v20.9,56 | v20.8,26.7 23.4,24.1 27.45,24.1 | 27.45,24.1 J10.12 | v48.8,25.6 44.7,25.6 42,22.9 29.9,22.9 28.7,24.1 27.45,24.1
  Bottom 0.61: v49,22.1 48.77,21.87 48.77,21.4
  Bottom 0.813: v20.9,56 20.8,55.9 v20.8,26.7 | v48.8,25.6 48.77,25.57 48.77,21.4 v48.77,14.38
+VDDCR
  Top 0.305: IC16.6 42.67,62.98 C88.2 C87.1
_ETH_CRSDV
  Top 0.305: IC16.11 44.16,68.96 46.1,70.9 46.8,70.9 47.4,71.5 R67.1 R73.2
_ETH_MDC
  Top 0.305: IC16.13 42.67,70.5 43.07,70.9 43.6,70.9 44.1,71.4 R75.2
_ETH_MDIO
  Top 0.305: IC16.12 43.67,69.47 45.2,71 45.2,71.7 R74.2 R65.1
_ETH_RXD0
  Top 0.305: IC16.8 45.86,67.44 46.3,67 46.3,65.9 46.5,65.7 R71.2 R69.1
_ETH_RXD1
  Top 0.305: IC16.7 45.37,66.93 45.6,66.7 45.6,64.8 46.7,63.7 R68.1 R72.2
_ETH_RXERR
  Top 0.305: IC16.10 44.3,68.45 44.57,68.73 44.85,69 46.05,70.2 R79.2
_ETH_TXD0
  Top 0.305: R77.2 39.7,71.65 40.64,70.71 IC16.17
_ETH_TXD1
  Top 0.305: IC16.18 40.13,70.57 38.6,72.1 R78.2
_ETH_TXEN
  Top 0.305: IC16.16 41.15,70.85 40.8,71.19 R76.2
ADC2_WIND_DIR  (via drill 0.3 pad 0.6)
  Top 0.305: IC6.37 39.05,51.75 38.8,51.99 37.85,51.99 C92.1 37.65,53.05 37.4,53.3 36,53.3 34.8,52.1 19.8,52.1 v19.7,52 | v19.7,31.9 19.7,31.1 19.6,31 | R86.1 19.6,31 | 19.6,31 18.3,31 18.2,30.9 17.64,30.9 J5.1
  Bottom 0.305: v19.7,52 v19.7,31.9
ADC3_BAT_VOLTAGE  (via drill 0.3 pad 0.6)
  Top 0.305: C101.1 55.25,57.8 IC6.14 55.25,52.3 54.39,51.44 51.06,51.44 50.7,51.07 48.2,51.07 47.42,51.85 43.65,51.85 42.4,53.1 40.5,53.1 39.6,54 35.8,54 34.8,53 v21.96,53 | R116.2 v11.9,71.9 | v11.9,60.4 19,60.4 v22,57.4
  Top 0.61: R114.1 R116.2
  Bottom 0.305: v11.9,71.9 v11.9,60.4 | v21.96,53 22,53.05 22,57.13 22,57.14 v22,57.4
ANEMOMETER  (via drill 0.3 pad 0.6)
  Top 0.305: IC6.56 39.84,42.25 38.98,43.11 35.44,43.11 34.65,43.91 C93.1 34.65,44.85 34.4,45.1 34.4,45.09 v22.2,45.09 | J5.3 17.57,28.5 R87.1 20.1,29.3 20.3,29.5 v22.2,29.5
  Bottom 0.305: v22.2,45.09 v22.2,29.5
CAM_PWDN  (via drill 0.3 pad 0.6)
  Top 0.305: R38.2 71.64,27.94 65.1,27.94 64.09,28.96 53.34,28.96 53.1,29.2 v52.3,29.2 | v52.3,34.4 52.25,34.35 IC6.89
  Bottom 0.305: v52.3,29.2 v52.3,34.4
CAM_PWR_IOVDD_EN  (via drill 0.3 pad 0.6)
  Top 0.305: 80.65,33.05 R36.2 80.65,33.95 Q4.1 80.65,33.05 | v79.91,32.7 80.3,32.7 80.65,33.05 | IC6.87 51.25,30.95 51.8,30.4 62.45,30.4 63.35,31.3 v79.91,31.3
  Bottom 0.305: v79.91,32.7 v79.91,31.3
CAM_RESET  (via drill 0.3 pad 0.6)
  Top 0.305: v52.8,28.5 62.2,28.5 63.5,27.2 63.5,25.1 63.9,24.7 69.9,24.7 R39.2 | IC6.90 52.75,33.99 52.91,34.15 52.91,34.65 52.88,34.67 v52.88,34.88
  Bottom 0.305: v52.8,28.5 52.8,28.84 52.91,28.95 52.91,34.65 52.88,34.67 v52.88,34.88
DCMI_D0  (via drill 0.3 pad 0.6)
  Top 0.305: R22.2 88,47.6 87.3,46.9 85.52,46.9 v78.09,46.9 | v78.1,32.4 64.2,32.4 62,34.6 56.3,34.6 55.75,34.05 IC6.96
  Bottom 0.305: v78.09,46.9 v78.09,32.41 v78.1,32.4
DCMI_D1  (via drill 0.3 pad 0.6)
  Top 0.305: R23.2 88.7,46.2 v82.05,46.2 | v82,32.01 78.56,32.01 78.35,31.8 64.16,31.8 61.81,34.14 56.59,34.14 56.25,33.8 IC6.97
  Bottom 0.305: v82.05,46.2 82.05,32.06 v82,32.01
DCMI_D2
  Top 0.305: IC6.141 66.25,50.25 67.5,49 R24.2
DCMI_D3
  Top 0.305: IC6.142 67.15,50.75 67.9,50 R25.2
DCMI_D4
  Top 0.305: R27.2 66.85,35 66.1,35.75 IC6.112
DCMI_D5
  Top 0.305: IC6.117 64.7,38.25 64.95,38.5 R28.2
DCMI_D6
  Top 0.305: IC6.139 66.05,49.25 67.3,48 R29.2
DCMI_D7
  Top 0.305: IC6.5 59.75,56.47 61.2,57.92 R30.2
DCMI_D8
  Top 0.305: R31.2 67.2,34 65.95,35.25 IC6.111
DCMI_D9
  Top 0.305: R32.2 66.5,36 66.25,36.25 IC6.113
DCMI_HSYNC
  Top 0.305: R34.2 64.55,54.6 60.96,51.01 57.8,51.01 57.41,50.61 44.12,50.61 43.76,50.25 IC6.40
DCMI_PIXCLK
  Top 0.305: R33.2 64.1,53.5 60.3,49.7 44.5,49.7 44.05,49.25 IC6.42
DCMI_VSYNC
  Top 0.305: IC6.124 68.15,41.75 R35.2
DEBUG_JTCK-SWCLK  (via drill 0.3 pad 0.6)
  Top 0.305: IC6.109 64.55,34.25 64.75,34.04 v64.75,33.73 | v64.8,30.2 68.07,30.2 68.87,29.4 JP2.4
  Bottom 0.305: v64.75,33.73 64.75,30.25 v64.8,30.2
DEBUG_JTMS-SWDIO  (via drill 0.3 pad 0.6)
  Top 0.305: JP2.2 64.62,29.07 64.28,29.41 59.95,29.41 v59.8,29.56 | v59.8,31 60.02,31.22 60.03,31.22 60.25,31.44 IC6.105
  Bottom 0.305: v59.8,31 v59.8,29.56
ESP32_RESET  (via drill 0.3 pad 0.6)
  Top 0.305: S1.2 S1.1 82.11,8.9 v54.3,8.9 | IC15.3 v88.87,28.9 88.87,29.57 89,29.7 | IC6.92 v53.75,31.01 v53.75,31 | R60.2 89,29.7 | 89,29.7 89.45,29.7 C77.1
  Bottom 0.305: v54.3,8.9 54.3,12.8 53.75,13.36 v53.75,31 | v88.87,28.9 88.87,7.53 89.14,7.26 S1.2
ETH_BIAS
  Top 0.305: IC16.24 39.06,66.5 35.7,66.5 R80.1
ETH_CRS_DV  (via drill 0.3 pad 0.6)
  Top 0.305: R73.1 48.4,73.8 v48.7,74.1 | v48.49,48.85 48.38,48.75 IC6.43
  Bottom 0.305: v48.7,74.1 48.27,73.67 48.27,58.52 48.65,58.15 49.08,57.72 49.08,53.88 48.6,53.4 48.6,48.97 v48.49,48.85
ETH_LED_ACT  (via drill 0.3 pad 0.6)
  Top 0.305: v38.6,57.2 31.88,57.2 31.43,56.74 29.97,56.74 29.7,57.02 R83.2 | v38.5,65.29 38.65,65.44 40.13,65.44 40.64,65.94 IC16.2
  Top 0.381: R83.2 J4.1
  Bottom 0.305: v38.5,65.29 38.5,57.3 v38.6,57.2
ETH_LED_SPD  (via drill 0.3 pad 0.6)
  Top 0.305: IC16.3 41.15,65.7 40.28,64.83 v39.11,64.83 | v38.7,69.9 35.7,69.9 32.62,72.98 v28.8,72.98
  Top 0.381: J4.12 v28.8,70.61 R84.2
  Bottom 0.305: v38.7,69.9 39.1,69.5 39.1,66 39.11,66 v39.11,64.83 | v28.8,72.98 v28.8,70.61
ETH_MDC  (via drill 0.3 pad 0.6)
  Top 0.305: R75.1 v44.1,73.9 | v44.1,75.99 v48.1,75.99 v48.11,76 | IC6.27 48.75,54.8 48.45,55.1 v48.45,55.75
  Bottom 0.305: v44.1,73.9 v44.1,75.99 | v48.11,76 47.81,75.7 47.81,58.34 48.45,57.7 v48.45,55.75
ETH_MDIO  (via drill 0.3 pad 0.6)
  Top 0.305: R74.1 45.2,74.3 44.99,74.5 43.85,74.5 43.84,74.5 v43.49,74.5 | v41.2,54.39 44.25,54.39 IC6.36
  Bottom 0.305: v43.49,74.5 43.49,72 44.2,71.3 44.2,64.5 41.21,61.51 v41.21,54.4 v41.2,54.39
ETH_REF_CLK  (via drill 0.3 pad 0.6)
  Top 0.305: IC16.14 42.16,70.86 43,71.7 R66.1 v43,71.6 | IC6.35 44.75,54.64 44.39,54.99 v40.6,54.99
  Bottom 0.305: v43,71.6 43.66,70.94 43.66,64.71 40.6,61.66 v40.6,54.99
ETH_RST  (via drill 0.3 pad 0.6)
  Top 0.305: IC6.47 40.35,46.75 v40.05,47.05 | R70.1 v41.9,71.6 41.9,71.3 41.65,71.05 IC16.15 | R85.2 32.7,60.7 34.1,59.3 39.8,59.3 v40,59.1
  Bottom 0.305: v40.05,47.05 40,47.1 v40,59.1 40,61.7 43.2,64.9 43.2,70.3 v41.9,71.6
ETH_RX_N  (via drill 0.3 pad 0.6)
  Top 0.305: 38.3,67.78 38.37,67.78 38.53,67.95 IC16.22
  Top 0.381: J4.8 v28.4,65.53 28.4,65.6 30.58,67.78 38.3,67.78 | R61.1 v28.41,62.9
  Bottom 0.381: v28.41,62.9 v28.41,65.52 v28.4,65.53
ETH_RX_P  (via drill 0.3 pad 0.6)
  Top 0.305: IC16.23 38.74,67.44 38.5,67.2
  Top 0.381: J4.7 v29.1,64.51 29.1,65.27 31.03,67.2 38.5,67.2 | R62.1 v29.1,61.8
  Bottom 0.381: v29.1,61.8 v29.1,64.51
ETH_RXD0  (via drill 0.3 pad 0.6)
  Top 0.305: R71.1 48.3,65.8 v50.21,65.8 | v49.09,48.4 48.95,48.25 IC6.44
  Bottom 0.305: v50.21,65.8 50.21,64.41 49.54,63.74 49.54,53.55 49.09,53.1 v49.09,48.4
ETH_RXD1  (via drill 0.3 pad 0.6)
  Top 0.305: R72.1 50.63,62.7 v50.65,62.69 | IC6.45 50.35,47.75 v51.01,48.4
  Bottom 0.305: v50.65,62.69 51.01,62.33 v51.01,48.4
ETH_TX_EN  (via drill 0.3 pad 0.6)
  Top 0.305: IC6.126 45.55,42.75 v45.5,42.7 | v46.9,76.6 v46.9,76.59 42.3,76.59 40.8,75.1 R76.1
  Bottom 0.305: v46.9,76.6 46.9,44.1 v45.5,42.7
ETH_TX_N  (via drill 0.3 pad 0.6)
  Top 0.305: IC16.20 38.84,68.96 38.6,69.2
  Top 0.381: 38.6,69.2 35.5,69.2 32.42,72.28 21.92,72.28 v21.9,72.3 | v21.9,61.3 22.05,61.45 24.9,61.45 J4.4 28.25,61.45 29,60.7 R63.1
  Bottom 0.381: v21.9,72.3 21.9,72.27 21.88,72.24 21.88,61.32 v21.9,61.3
ETH_TX_P  (via drill 0.3 pad 0.6)
  Top 0.305: IC16.21 38.55,68.45 38.4,68.6
  Top 0.381: 38.4,68.6 35.27,68.6 32.22,71.66 22.24,71.66 22.19,71.61 21.51,71.61 21.46,71.66 v21.16,71.66 | v21.26,60.66 21.48,60.43 25,60.43 J4.3 28.07,60.43 28.9,59.6 R64.1
  Bottom 0.381: v21.16,71.66 21.2,71.61 21.2,60.71 v21.26,60.66
ETH_TXD0  (via drill 0.3 pad 0.6)
  Top 0.305: IC6.128 45.95,43.75 45.9,43.8 45.04,43.8 v44.9,43.95 | R77.1 39.7,74.65 42.25,77.2 v46.2,77.2
  Bottom 0.305: v46.2,77.2 46.2,76.44 46.44,76.2 46.44,45.5 v44.9,43.95
ETH_TXD1  (via drill 0.3 pad 0.6)
  Top 0.305: v47.5,77.8 v47.49,77.81 42.21,77.81 38.6,74.19 R78.1 | v47.6,44.35 47.7,44.25 IC6.129
  Bottom 0.305: v47.5,77.8 v47.51,77.8 47.51,76.3 47.36,76.15 47.36,44.6 v47.6,44.35
ETH_XTAL
  Top 0.305: Q7.3 38.17,64.63 38.6,64.2 40.7,64.2 42.16,65.66 IC16.5
GAUGE  (via drill 0.3 pad 0.6)
  Top 0.305: IC6.57 40.17,41.75 v40.06,41.65 | J7.3 19.66,44.47 R96.1 19.7,45.3 20.1,45.7 37.6,45.7 | 37.6,45.7 v40.1,45.7 | C94.1 37.65,45.75 37.6,45.7
  Bottom 0.305: v40.1,45.7 40.1,41.68 v40.06,41.65
GND  (via drill 0.3 pad 0.6, 0.35)
  Top 0.305: IC6.16 54.25,57.4 54,57.65 v54,59.45 | C29.2 v54,59.45 | v54,59.45 C101.2 | IC6.130 67.05,44.75 67.4,44.4 69.4,44.4 69.65,44.65 C23.2 v70.5,45.2 | R54.1 94.25,70.85 94.25,71 | IC12.39 88,93.8 IC12.78 | IC12.45 82,95.2 80.8,94 80.8,97.2 IC12.46 | IC12.54 75.3,92 76.4,93.1 IC12.81 | C38.2 C39.2 | Q16.4 46.45,57.6 C96.2 44.4,59.65 C30.2 | C97.2 49.95,59.8 Q16.2 v48.9,58.75 | IC6.120 67.07,39.75 67.37,39.45 68.89,39.45 C24.2 v70.5,40.2 | v70.5,47 R112.1 | Q5.E 91.65,69.66 91.7,69.61 | R45.1 92.9,72 93.3,71.6 94.05,71.6 C74.2 | R102.1 48.95,18.35 | 48.95,18.35 Q13.2 | 48.95,18.35 48.95,18.05 | R107.1 55,18 | 55,18 R108.1 | Q15.2 55,19.85 55,18 | Q11.2 v48.95,9.7 | R97.1 49,9 | 49,9 R98.1 | 49,9 48.95,9.05 | R91.1 64,18.4 | 64,18.4 R92.1 | Q9.2 64,19.85 64,18.4 | C42.2 50.4,25.35 50.45,25.3 | C27.2 50,25.35 50,25.52 49.25,26.27 IC6.83 | C28.2 36.05,39.7 C43.2 36.05,41.85 36.4,42.2 38.6,42.2 39,41.8 39,40.51 39.76,39.75 IC6.61 | C35.2 60.95,25.05 v61.2,25.3 61.95,25.3 C25.2 | v61.42,31 61.27,31.15 61.27,31.25 61.25,31.28 IC6.107 | IC6.94 54.75,31.36 54.5,31.11 v54.5,31 | IC6.51 38.13,44.75 38.13,44.76 36.7,44.76 36.35,44.41 C32.2 | C91.2 34.1,66.3 | 34.1,66.3 R80.2 | 34.1,66.3 34.1,64.13 35.11,63.11 Q7.2 | 65.19,62.3 v65.24,62.35 | R10.1 4.15,75.2 Q2.2 | IC6.38 40.05,51.25 38.8,50 36.4,50 36.35,50.05 C92.2 | IC9.10 95.35,43.25 v95.9,42.7 | IC9.23 95.55,36.75 v95.6,36.7 | IC6.31 46.75,52.65 46.5,52.4 45.85,52.4 v45.8,52.45 | J7.2 19.14,45.73 19.8,46.4 25.4,46.4 25.74,46.74 S3.2
  Top 0.406: v96.3,70 96.2,69.9 94.25,69.9 | IC14.2 97.9,85.08 97.22,84.4 v96.6,84.4 | 94.25,69.9 94.25,71 C74.2 | IC12.18 92,78 IC12.73 | IC12.29 98.1,89 98.65,89.55 C63.2 | L6.1 94.25,69.61 94.25,69.9 | R46.1 68.35,69.55 Q6.E | IC13.7 65.19,62.3 | v65.19,59.3 IC13.8 | v65.24,62.35 C68.2 v75.3,62.35 76.2,62.35 | 76.2,62.35 v83.3,62.35 84.05,62.35 84.9,63.2 86.21,63.2 86.31,63.1 | IC11.7 76.19,62.36 76.2,62.35 | C71.2 74.65,59.8 75.8,59.8 76.19,59.41 IC11.8 76.19,57.2 75.69,56.7 C70.2 | R81.2 30.7,58.3 | C86.2 31.85,58.3 | C45.2 C44.2 55.9,80.1 56.7,79.3 56.7,75.7 55.91,74.91 IC7.4 | C3.2 33.45,91 C2.2 | C2.2 v34.7,90.7 IC1.2 v36.9,90.7 | R4.1 32.8,88.85 | 32.8,88.85 C4.2 | C2.2 33.75,90.35 v33.1,89.7 32.8,89.4 32.8,88.85 | R5.1 36.9,88.8 v36.9,89.2 v36.9,89.9 v36.9,90.7 | C5.2 v36.9,90.7 | Q9.2 62.81,21.04 61.36,21.04 v61.2,21.2 | Q13.2 50.05,21 53.85,21 Q15.2 | J2.P6 89.71,64.66 v89.75,64.7 | J2.P2 94.53,55.33 v94.7,55.5 | J2.P3 98.37,57.27 v98.4,57.3 | J2.P4 98.2,64.3 v96.9,64.3 | J2.P5 92.69,64.7 v92.8,64.7 | v95.6,36.7 96,36.7 96.9,35.8 | 96.9,35.8 97.09,35.61 | 96.9,35.8 97.49,35.21 98.8,35.21 | IC9.25 98.46,34.76 v98.8,35.1 | v98.8,34.1 98.8,34.26 IC9.25 | IC9.25 98.46,34.46 v98.1,34.1 | IC9.26 98.46,49.24 v98.8,48.9 | IC9.26 98.46,49.56 v98.8,49.9 | IC9.26 98.46,49.54 v98.1,49.9 | IC9.25 98.1,34.96 v98.1,35.1
  Top 0.5: 72.6,86.9 IC12.59 72.6,86.9 | 72.6,86.9 59.4,86.9 | 72.6,85.1 IC12.61 | 59.4,85.1 72.6,85.1 | 72.6,86.9 73.41,86.9 73.41,85.1 72.6,85.1
  Top 0.508: C46.2 84.8,38.6 85.2,39 89.35,39 | IC8.2 88.8,32.2 88.4,31.8 83.3,31.8 82.55,32.55 82.55,33.5 Q4.2 | 94.25,69.61 91.7,69.61 90.61,69.61 90.3,69.3 FL1.9 90.3,67.22 90.29,67.22 90.29,67.14 C67.2 C66.2 v89.75,64.7 | IC12.17 92,78 | v72.9,50.4 C41.2 | C27.2 50.4,25.35 | 86,50 R37.1 84.45,48.5 C52.2 | 86,50 C53.2 | IC10.2 86,50 | v54.4,25.3 50.45,25.3 | R83.1 30.7,58.3 31.85,58.3 | C37.2 C30.2 v44.2,60.4 C87.2 47.75,61.25 47.9,61.4 v48.89,61.4 v48.9,61.41 | C88.1 41.1,61.25 C83.2 39.02,61.25 38.38,61.9 35.13,61.9 35.11,61.91 35.11,63.11 | R84.1 R82.2 v32.7,68.8 | v32.7,65.62 33.25,66.17 C91.2 | R79.1 v48.91,70.2 | v48.91,68.7 48.55,68.7 48.35,68.5 C89.2 C90.2 | R115.1 v23,12.7 | v23.1,10.7 IC17.2 | v23,8.6 22.25,8.6 | 22.25,8.5 22.05,8.7 C100.2 | 22.05,6.3 L8.1 v23,6.3 | v70.5,47 v72.9,47 | 86.31,63.1 J2.C5 89.68,63.18 v89.7,63.2 | C69.2 83.61,67.45 83.32,67.74 v83.32,68.14 | IC3.1 30.1,53.9 27.7,53.9 | C10.2 26.3,53.91 26.3,53.9 27.7,53.9 | C11.2 27.7,54.75 27.7,53.9 | v55.29,15.99 55.7,15.58 R99.1 | R100.1 52.5,10.6 52.8,10.9 58.7,10.9 59.25,11.45 J6.1 | R103.1 48.9,18 | 48.9,18 R102.1 | Q13.2 48.95,18.05 48.9,18 | C86.2 32.75,58.35 33.21,57.89 v34.4,57.89
  Top 0.61: C48.2 C47.2 | C47.2 86.95,34.55 87.4,34.1 88.8,34.1 IC8.2 88.8,30.7 | C46.2 86.03,34.55 86.09,34.56 C47.2 | C49.2 89.35,39 C51.2 89.35,42.45 R41.1 | R40.1 93.7,30.8 v93.6,30.7 | 41.1,61.25 41.1,62.8 v40.5,63.4 | v37.5,74.7 C84.2 | v29.7,79.2 R12.1 | v29.7,78 C17.2 28.95,76.85 v28.9,76.8 | C19.2 C20.2 60.15,79.3 IC5.2 64.95,79.3 C21.2 | R116.1 v9.3,72.7 | Q2.2 5.25,75.15 v5.3,75.1 | C31.2 v34.4,51.1 v25.74,51.1 | v34.4,53.91 C12.2 | v34.4,46.6 C94.2 | v34,42.7 33.3,42.7 | 33.3,42.7 33.3,41.8 32.85,41.35 C95.2 | 33.3,42.7 33.3,43.95 C93.2 | C32.2 36.35,44.45 v35.8,45 | v34,39.4 C28.2 | C26.2 36.35,34.7 C34.2 35.95,35.1 v34,35.1 34,34 J9.3 | v34,25 34,24.1 | 34,24.1 33.98,24.08 J10.11 | LED2.C 40.9,24.1 34,24.1 | R99.1 55.7,15.7 v58.2,15.7 | v59.65,15.7 v58.2,15.7 | v58.2,15.7 60.4,15.7 61.4,14.7 68.5,14.7 v68.6,14.8 | v68.6,2.7 71.7,2.7 | 71.7,2.7 72.71,2.7 S2.3 S2.4 S1.4 90.49,2.5 97.6,2.5 98.65,3.55 98.65,6.57 JP1.3 | J8.1 v68.6,4 | C78.2 71.7,4.15 71.7,2.7 | IC15.40 v91.41,11.49 v91.4,11.5 | C79.- 98.65,21.18 LED1.C | R36.1 82.55,33.5 | 92,30.7 89.6,30.7 | 89.6,30.7 88.8,30.7 | 88.8,30.7 R60.1 | C77.2 89.6,30.7 | C82.2 97.5,29.9 | C81.2 97.53,27.9 | C80.- 97.53,24.8 | IC10.2 v89,50 | v89,54.6 85.55,54.6 C75.2 C76.2 81.9,55.25 81.04,54.4 75.25,54.4 v74.65,54.99 C70.2 | C98.2 C99.2 v60,66.1 | C39.2 60,59.75 v60,60.5 | C90.2 50.6,66.8 v54,63.4 | v34.4,61.9 35.1,61.9 35.11,61.91 | C22.2 C41.2 | Q15.2 55.16,19.69 v55.16,18.8 | J11.1 44.05,5.3 v49.1,5.3 | R100.1 52.5,8.5 52,8 51,8 50.5,8.5 R98.1 50.45,9.05 48.95,9.05 v48.95,9.7 | IC15.44 IC15.45 IC15.46 | IC15.44 85,21.9 | 85,21.9 IC15.43 v91.4,21.9 | IC15.46 83.8,20.5 | IC15.42 | IC15.42 v91.4,20.5
  Top 0.61: IC15.48 IC15.49 | IC15.48 83.69,20.39 | 83.69,20.39 83.8,20.5 | IC15.44 83.8,21.79 83.8,20.5 | 85,21.9 85.09,21.81 IC15.42 | IC15.46 IC15.47 IC15.48 | IC15.49 IC15.42 | IC15.42 83.8,20.5 | IC15.41 83.69,20.39 | IC15.44 IC15.48 | IC15.49 85.19,19.2 v91.4,19.2 | v25.74,53.91 26.29,53.91 26.3,53.91
  Top 0.813: 92,30.7 v93.6,30.7 93.9,31 96.4,31 97.5,29.9 97.53,29.88 97.53,27.9 97.53,24.8 C79.- | C7.2 12.95,52.8 13.72,53.57 16.2,53.57 | C9.2 18.78,53.57 16.2,53.57 | 16.2,53.57 v16.2,53.6 v16.2,54.4 | 16.2,53.57 v16.2,52.6 | J5.2 19.27,29.73 v19.3,29.7 | v19.3,27.2 J5.4 | J12.MP2 10.7,16.4 v15.9,16.4
  Bottom 0.305: v61.2,25.3 61.2,27.54 61.3,27.64 61.3,30.89 v61.42,31 | v54.5,31 54.4,30.91 v54.4,25.3 | v48.9,58.75 v48.9,61.41
  Bottom 0.406: v65.24,62.35 65.24,59.35 v65.19,59.3 | v75.3,62.35 75.4,62.25 v75.4,59.8 | v96.6,84.4 96.3,84.1 v96.3,70
  Bottom 0.508: v70.5,47 v70.5,45.2 v70.5,40.2 70.5,28.16 JP2.3 | v72.9,50.4 72.9,49.9 v72.9,47 | v32.7,68.8 v32.7,65.62 | v48.91,70.2 v48.91,68.7 | v23,12.7 23.1,12.6 v23.1,10.7 23.1,9.7 23.1,8.71 v23,8.6 | v89.7,63.2 89.7,64.65 v89.75,64.7 | v83.32,68.14 83.3,68.13 v83.3,62.35 | v55.16,18.8 55.16,16.12 v55.29,15.99
  Bottom 0.61: v40.5,63.4 41,63.9 v41,67.7 | v41,68.6 41,71.2 v37.5,74.7 | v9.3,72.7 9.3,75.1 | 9.3,75.1 9.3,77 J1.2 | v5.3,75.1 9.3,75.1 | 34.4,45 v34.4,46.6 v34.4,51.1 v34.4,53.91 v34.4,57.89 v34.4,61.9 | 34.4,45 34.4,43.7 34,43.3 v34,42.7 v34,39.4 v34,35.1 v34,25 34,11.1 v32.6,9.7 | v35.8,45 34.4,45 | v58.2,15.7 58.2,14.05 J6.1 | v61.2,25.3 v61.2,21.2 | JP2.3 68.6,26.26 v68.6,14.8 v68.6,4 v68.6,2.7 | v91.4,11.5 v91.4,19.2 v91.4,20.5 v91.4,21.9 93.6,24.1 v93.6,30.7 93.6,34.7 v95.6,36.7 96.4,37.5 96.4,40.4 96.5,40.5 96.5,42.1 v95.9,42.7 | v89,50 v89,54.6 | 72.9,49.9 72.9,53.24 v74.65,54.99 | v60,60.5 60,63.4 | 60,63.4 v60,66.1 | v54,59.45 v54,63.4 60,63.4 | v45.8,52.45 45.8,54 44.2,55.6 v44.2,60.4 | v49.1,5.3 49.1,9.55 v48.95,9.7 | v24.86,9.7 23.1,9.7 | v25.74,53.91 v25.74,51.1 S3.2 S3.1
  Bottom 0.813: v19.3,29.7 v19.3,27.2 19.3,26.5 21.33,24.47 22.03,24.47 24.25,22.25 24.59,21.91 24.59,21 24.59,15.9 23,14.3 | v22.9,3.9 23,4 v23,6.3 22.09,6.3 21,7.4 22.2,8.6 v23,8.6 23,14.3 | v15.9,16.4 18,14.3 23,14.3
  other vias: 40.4,69.2 42.4,69.2 41.8,68.6 41.8,67.7 40.4,67.2 42.4,67.2 39.2,90.6 23.5,85.1 24.2,85.1 25,85.1 25.7,85.1 22.4,79.3 23.2,78.6 24,77.9 22.6,77.9 23.4,77.3 24.3,76.7 22.8,76.2 23.6,75.7 24.4,75.3 20.5,74.4 21.4,74.4 18.7,73.6 17.7,73.6 16.7,73.6 15.8,73.6 13,52.8 45.5,91.2 45.5,90.4 45.5,89.6 45.5,88.8 45.5,88 64.1,64.1 64.1,63 71.6,59.9 66.2,71 73.9,68.8 73.9,67.1 73.9,65.2 77.9,65.2 79.5,68.9 83.2,59.6 84.9,58.7 90.1,60.5 92.6,62.6 98.4,62.4 95,59.2 96.5,55.5 98.5,52.6 93,71.5 93,70.5 13.7,75.8 2.6,73.1 2.6,71 10.5,66.8 10.5,64.7 13.3,64.7 13.3,66.8 22.1,58.9 20.6,57.4 12.5,57.4 9.3,56.3 7.9,57.9 8.2,61 2.8,63.1 2.7,57.9 1.3,52.2 9.8,51 16.2,50.9 15.6,45.9 15.3,43.3 28,58.3 28.1,69.7 22.6,69.7 20.2,69.7 20.1,61.7 31.7,70.5 36,70.9 43,79.6 44.2,79.6 45.3,79.6 46.4,79.6 49.2,76.4 40.9,49.8 40.9,47.8 37.2,48.4 32,49.6 32,46.5 28.4,46.7 61.3,36.2 59.4,39.8 57.3,39.9 56.9,37.3 54.4,39.9 46.3,34.1 47.6,34.1 46.4,39.7 48.6,40 55.5,48 57,48 56.3,51.8 58.6,51.8 62.1,48 74.4,51.3 77.5,51.1 79.9,51.2 82.8,51.4 81.6,48.8 72.5,39.5 62.1,39.8 86.4,41 85.4,39.4 87.4,38.6 85,35.6 86.8,35.5 84,32.1 87,31.7 70.9,24.3 69.1,22.3 69.1,18.9 59.7,17.4 61.3,7 66.5,6.7 70.4,8.1 51.2,8 45.4,9.8 43.6,9.2 43.7,12.5 45.6,12.5 46.1,4.3 44.4,2.2 49.1,1.3 57.8,1.2 42.3,2.2 34.1,4.9 36.5,4.9 31.4,5 29,5 26.5,5 30.2,16 31.8,12.6 30.3,18.6 29.3,20.3 30.4,23.8 28.5,22.8 28.2,25.3 28.6,27.7 36.4,26.5 28.7,30.2 30.2,31 34.6,30.4 36.7,36.2 31.9,35.2 24.3,36.7 24.3,38.7 31.1,37.9 29.5,53.8 23.1,54.9 36.9,54.9 32.9,58 35.7,61.1 26.5,73.7 29.1,74.2 57.6,75.1 56.5,70.9 60.9,76.4 58.2,67.4 62.6,77.2 62.6,78.4 62.6,79.3 62.6,80.2 60,22.7 38.2,24.1 38.7,12.7 35.7,12.7 38.6,9.3 41.9,9.3 59.1,10.8 62.8,10.7 66.6,10.7 68.4,10.8 64.3,7.9 94,15.8 98.9,8.4 89.8,18.1 91.2,13.3 75.3,11.8 85.1,11.8 75.3,22 87.7,22.2 89.7,22.2 98.5,26.8 98.7,20.4 98.8,17.9 97.7,30 92.6,49 91.6,49.9 89,51.4 89,48.8 86.1,49.4 91.3,51.7 82.6,55.4 60.9,96.6 64.2,96.6 68.9,95.4 69.8,95.4 70.8,95.4 71.5,77.5 66.4,79 77,75.7 92,75.7 93.1,74.7 94.3,77.9 94.3,76.9 94.2,89 95.3,95.2 98.5,95.7 98.4,98.6 93.3,98.6 88,96.3 88,98.6 82,96.2 81.1,96.2 81,98.5 82,98.5 73.6,92 73.8,88 73.8,87 71.4,93.8 80.1,89.9 87.7,89.9 84,86 87.8,82.2 80.2,82.3 96.6,89 96.6,87.3 77.8,48.8 74.7,45 74.7,47.1 65.6,39.4 66.5,39.4 66.8,44.5 86.3,64.7 87.1,64.7 92,64.7 98.08,64.73 98.62,64.19 98.63,55.27 98.09,55.81 92.1,55.3 93.1,55.3 86.7,55.4 87.5,55.4 98.1,48.9 77.5,56.7 73.7,59.6 61.3,62.6 61.2,65 57.5,66.1 46.3,37.4 47.6,37 41.7,33.2 80,22 67,84.75 69,84.75 71,84.75 65,84.75 63,84.75 61,84.75 59.75,83.5 57,84.25 57,85.5 57,87.75 61,87.25 57,86.5 63,87.25 65,87.25 67,87.25 69,87.25 71,87.25 58,83.5 58,88.5 59.75,88.5 73.8,86 73.8,84.75 71.05,83.5 71.05,82 71.05,80.5
  pour Top (isolate 0.305, rank 2, no thermals): 32.7,92.9 32.9,93.1 33.6,93.1 33.9,93.1 34.1,92.9 34.1,92.1 34.8,91.4 36,91.4 40.1,91.4 40.5,91 40.5,90.1 40.2,89.8 37.9,89.8 37.9,88 37.7,87.8 36.3,87.8 35.6,88.5 35.6,89.1 35.4,89.3 33.8,89.3 33.2,89.3 32.8,89.7 32.7,89.8
  pour Top (isolate 0.305, rank 2, no thermals): 13.3,75 14.2,75.9 16.6,75.9 19.1,75.9 19.5,76.3 19.5,79.2 20.5,80.2 21.2,80.9 21.2,84.9 21.2,85.4 23.2,87.4 30.8,87.4 31.6,86.6 31.6,83.6 30.6,82.6 25.9,82.6 25.4,82.1 25.2,81.9 25.2,76.1 25.2,74 24.6,73.4 23.8,72.6 15.6,72.6 13.6,72.6 13.2,73 13.2,74.9
  pour Top (isolate 0.305, rank 2, no thermals): 28.5,79.6 29.9,79.6 30.1,79.4 30.2,79.3 30.2,78.5 30.3,78.4 37.8,78.4 41.9,82.5 47.7,82.5 47.7,79 47.2,78.5 46.9,78.2 42.7,78.2 37.4,72.9 34.7,72.9 24,72.9 24,73.7 25.1,74.8 27.8,74.8 28.3,75.3 28.3,79.4
  pour Top (isolate 0.305, rank 2, no thermals): 48.7,90.5 48.7,92.1 48.3,92.5 45.8,92.5 45.2,91.9 44.8,91.5 44.8,89.8 44.8,87.7 45.3,87.2 45.7,86.8 48.3,86.8 48.7,87.2
  pour Top (isolate 0.305, rank 2, no thermals): 0.7,92.3 6.2,92.3 6.7,91.8 8.1,90.4 8.1,87.5 8.1,83.1 8.9,82.3 12.7,78.5 12.7,77.7 12.7,77.3 12.1,76.7 8.5,76.7 0,76.7 0,92.3 0.6,92.3
  pour Bottom (isolate 0.305, rank 2, no thermals): 0,100 100,100 100,0 0,0
  pour Top (isolate 0.305, rank 2, no thermals): 0,100 73.4,100 73.4,77.5 75.6,75.3 93.1,75.3 94.9,77.1 94.9,100 100,100 100,0 0,0
  pour Top (isolate 0.305, rank 2): 73.4,100 94.9,100 94.9,77.1 93.1,75.3 75.6,75.3 73.4,77.5
  cutout Top: 73.2,40.9 73.2,38.8 75.3,38.8 75.3,40.9
  cutout Top: 75.1,45.9 75.1,43.9 75.5,43.9 75.5,45.9
  cutout Top: 55.1,49.3 55.1,47.7 54.4,47.7 54.4,49.3
  cutout Top: 45.9,40.3 45.9,38.6 45.5,38.6 45.5,40.3
  cutout Top: 45.9,37.9 45.9,33.8 45.5,34.2 45.5,37.9
  cutout Top: 37.2,27 37.2,25.5 37.5,25.2 37.8,25.2 37.8,27.1 37.7,27
  cutout Bottom: 42.7,13.1 46.3,13.1 46.3,13.5 42.8,13.5 42.7,13.4
  cutout Bottom: 60.9,20.4 63.3,20.4 63.3,20 61.1,20 60.9,20.2
  cutout Bottom: 46,40.6 49.2,40.6 49.2,41.1 46.2,41.1 46.2,40.8
  cutout Bottom: 65.3,42.3 64.2,41.2 64,41.4 65,42.4 65.2,42.4
  cutout Bottom: 75.4,22.6 79.5,22.6 82.6,25.7 82.6,25.9 82.5,26 82.1,26 79.9,23.8 76.6,23.8
  cutout Top: 51.6,58.8 52.5,58.8 52.5,58.5 51.6,58.5
I2C1_SCL  (via drill 0.3 pad 0.6)
  Top 0.305: v91.5,36.2 91.5,34.9 R20.1 | IC9.20 92.33,38.25 v91.55,37.48 | v74.39,43.86 74.25,43.71 67.52,43.71 67.12,43.31 66.15,43.31 v66,43.46 | IC6.136 64.94,47.75 65.15,47.54 65.65,47.54 65.75,47.64 v66,47.64 | v75,24.65 75.15,24.65 75.45,24.35 91.36,24.35 v91.5,24.5
  Bottom 0.305: v91.55,37.48 91.5,37.42 v91.5,36.2 v91.5,24.5 | v75,24.65 74.85,24.8 74.75,24.8 74.39,25.15 v74.39,43.86 | v66,43.46 v66,47.64
I2C1_SDA  (via drill 0.3 pad 0.6)
  Top 0.305: IC9.22 92.95,37.25 92.7,37 92.7,35.7 | v75,43.41 74.85,43.26 67.71,43.26 67.31,42.85 v65.4,42.85 | v65.4,48.15 65.3,48.25 IC6.137 | R21.1 92.7,35.7 | v75,25.4 75.1,25.4 75.69,24.81 90.96,24.81 91.59,25.44 v92.11,25.44 | 92.7,35.7 v92.11,35.7